# EAGLE design SMOOTHIELASER_BREAKOUT (EAGLE 7.4.0)
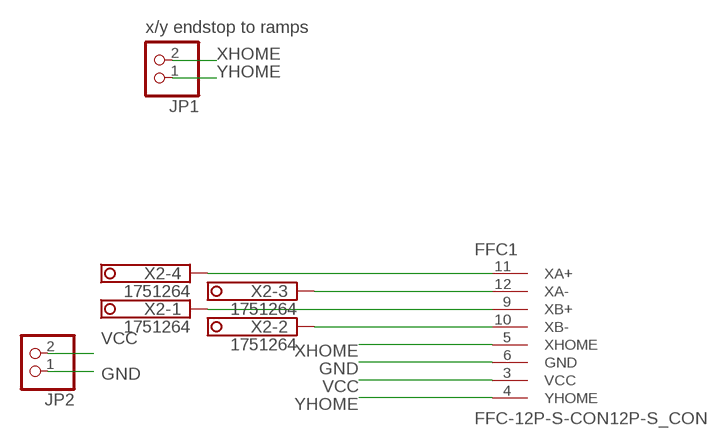
[diagram p0: schematic, sheet 1]

## Parts
FFC1  FFC-12P-S-CON12P-S_CON  [FFC]
JP1  PINHD-1X2  [1X02]
JP2  PINHD-1X2  [1X02]
X2  1751264  [1751264]

## Nets
GND: FFC1.6(GND) JP2.1
N$1: FFC1.11(XA+) X2.4
N$2: FFC1.12(XA-) X2.3
N$3: FFC1.10(XB-) X2.2
N$4: FFC1.9(XB+) X2.1
VCC: FFC1.3(VCC) JP2.2
XHOME: FFC1.5(XHOME) JP1.2
YHOME: FFC1.4(YHOME) JP1.1

## Notes on the sheet
- x/y endstop to ramps

## Library data of the parts
FFC1 = WeisTek:FFC-12P-S-CON
JP1 JP2 = pinhead:PINHD-1X2: PIN HEADER
X2 = con-phoenix-350:1751264: MKDS 1/ 4-3,5 Printklemme Nennstrom: 10 A Bemessungsspannung: 160 V Raster: 3,5 mm Polzahl: 4 Montageart: Löten Anschlussart: Schraubanschluss Anschlussrichtung vom Leiter zur Platine: 0° Source: http://eshop.phoenixcontact.com .. 1751264.pdf

## Board
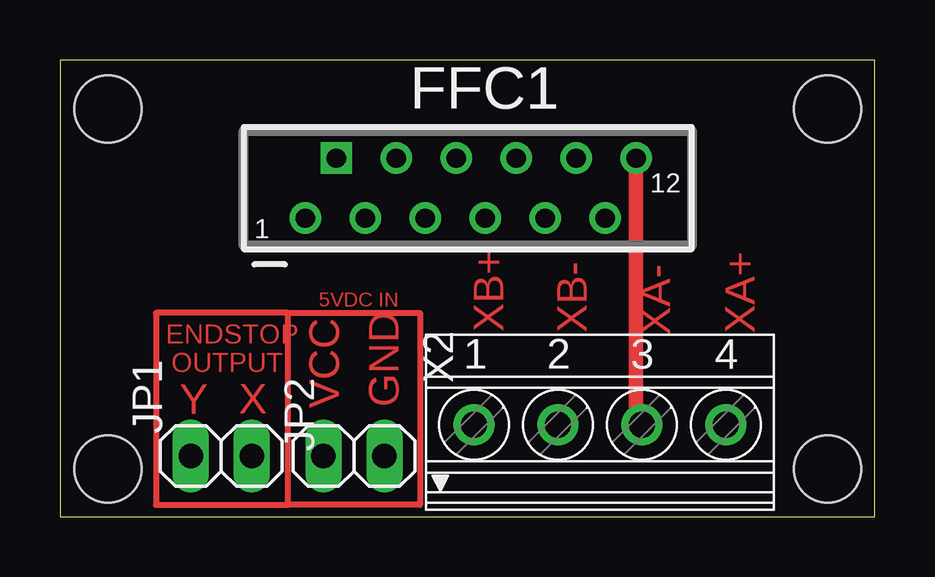
[diagram p1: board, top side]
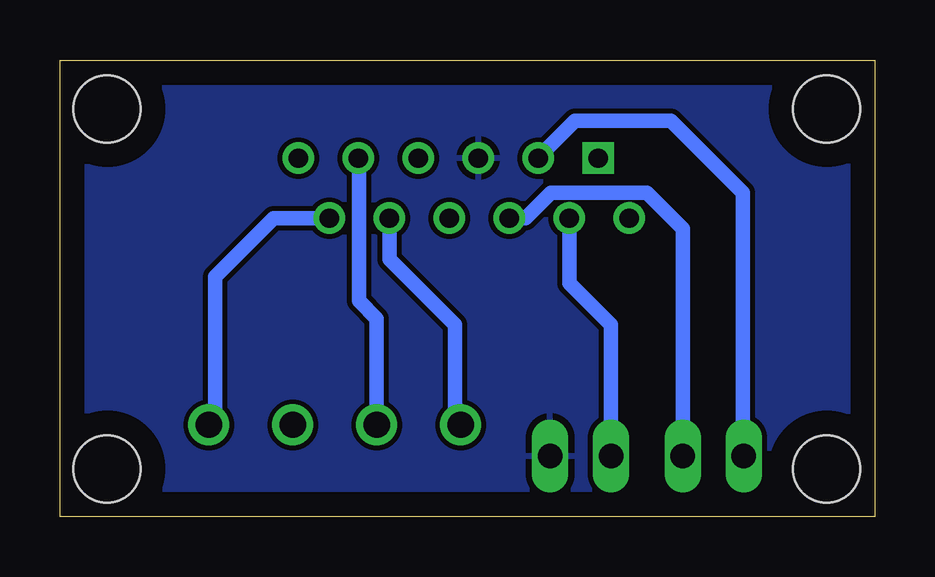
[diagram p2: board, bottom side, seen from below]

Size 33.96 x 19.04 mm. Coordinates in mm from the lower left corner, seen from the top.
Outline: 0,0 33.96,0 33.96,19.04 0,19.04 0,0
Copper layers (1*16): Top 0.035mm / dielectric 1.5mm / Bottom 0.035mm
Design rules "default": minimum track width 10mil, minimum drill 24mil, track to track 8mil, track to pad 8mil, pad to pad 8mil, via to via 8mil, smd to smd 8mil, copper to edge 40mil, drill to drill 8mil, minimum pad ring 10mil, minimum via ring 8mil, stop-mask expansion 4mil, vias tented up to drill 0mil, thermal gap 10mil
Holes 2.8 mm at 2,17 2,2 32,17 32,2

### Footprints (pad centres in the part's own frame; a part is rotated, then mirrored left to right if it is on the bottom)
FFC = drill 0.8: 1 6.77,1.25; 3 4.27,1.25; 4 2.98,-1.25; 5 1.77,1.25; 6 0.48,-1.25; 7 -0.73,1.25; 8 -2.02,-1.25; 9 -3.23,1.25; 10 -4.52,-1.25; 11 -5.73,1.25; 12 -7.02,-1.25 | drill 0.8 square: 2 5.48,-1.25
1X02 = drill 1.016 long: 1 -1.27,0; 2 1.27,0
1751264 = drill 1.1 pad 1.7: 1 -5.25,-0.1; 2 -1.75,-0.1; 3 1.75,-0.1; 4 5.25,-0.1

### Placement (x,y rotation side)
FFC1  17,13.7 180 top
JP1  6.73,2.54 0 top
JP2  12.25,2.54 180 top
X2  22.51,3.94 0 top

### Tracks (layer width: path | path; a pad name or v marks a point on that pad's centre or on a via)
GND
  pour Bottom: 0.45,18.67 33.42,18.67 33.42,0.32 0.45,0.32 0.45,18.62
N$1
  Bottom 0.61: FFC1.11 25.05,12.45 27.5,10 27.5,4.1 X2.4
N$2
  Top 0.61: FFC1.12 24.02,4.08 X2.3
N$3
  Bottom 0.61: X2.2 20.76,8.26 21.5,9 21.5,14.93
  Bottom 1.016: 21.5,14.93 FFC1.10
N$4
  Bottom 0.61: FFC1.9 20.23,10.73 17.5,8 17.5,4.08 X2.1
N$5
  Top 0.254: 9.5,0.5 4,0.5 4,8.5 9.5,8.5 | 9.5,0.5 9.5,8.5 | 9.5,8.5 15,8.5 15,0.5 9.5,0.5
VCC
  Bottom 0.61: FFC1.3 12.73,9.73 11,8 11,2.56 JP2.2
XHOME
  Bottom 0.61: FFC1.5 14.55,12.45 13.5,13.5 9.5,13.5 8,12 JP1.2
YHOME
  Bottom 0.61: FFC1.4 14.02,14.98 12.5,16.5 8.5,16.5 5.5,13.5 5.5,2.58 JP1.1

### Text on the board
Top: 5VDC IN | XB+ | XB- | XA- | XA+ | ENDSTOP | OUTPUT | VCC | GND | Y | X